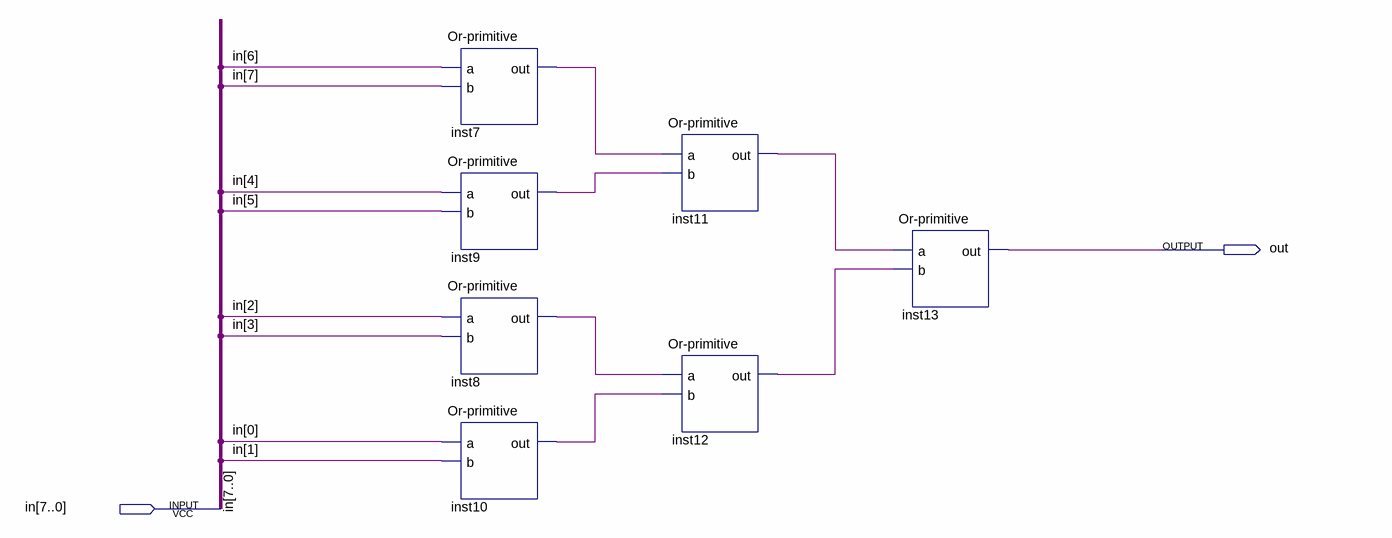
[diagram p0: schematic sheet]
// Quartus schematic Or8Way.bdf as structural Verilog: 7 symbols, 2 pins
module Or8Way (
  input  [7:0] in,
  output out
);

  wire inst7_out, inst8_out, inst9_out, inst10_out, inst11_out, inst12_out;

  \Or-primitive  inst7 (.a(in[6]), .b(in[7]), .out(inst7_out));
  \Or-primitive  inst9 (.a(in[4]), .b(in[5]), .out(inst9_out));
  \Or-primitive  inst8 (.a(in[2]), .b(in[3]), .out(inst8_out));
  \Or-primitive  inst10 (.a(in[0]), .b(in[1]), .out(inst10_out));
  \Or-primitive  inst11 (.a(inst7_out), .b(inst9_out), .out(inst11_out));
  \Or-primitive  inst12 (.a(inst8_out), .b(inst10_out), .out(inst12_out));
  \Or-primitive  inst13 (.a(inst11_out), .b(inst12_out), .out(out));
endmodule
